# EAGLE schematic 64Pin-Final (EAGLE 7.2.0)
64 Pin Board to mount PIC24FJ1024GB606E
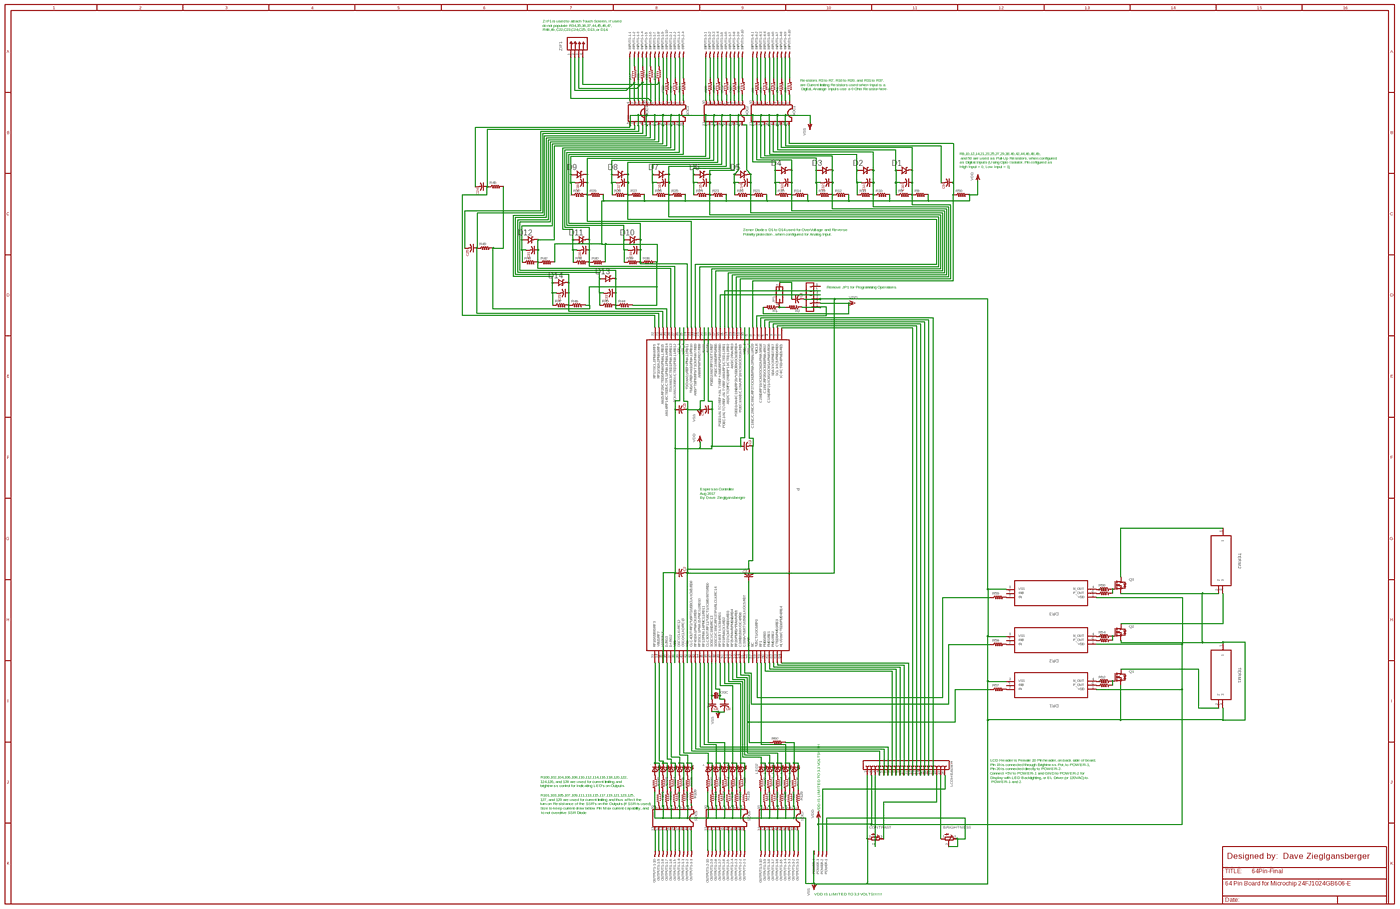
[diagram p0: schematic, sheet 1, overview]
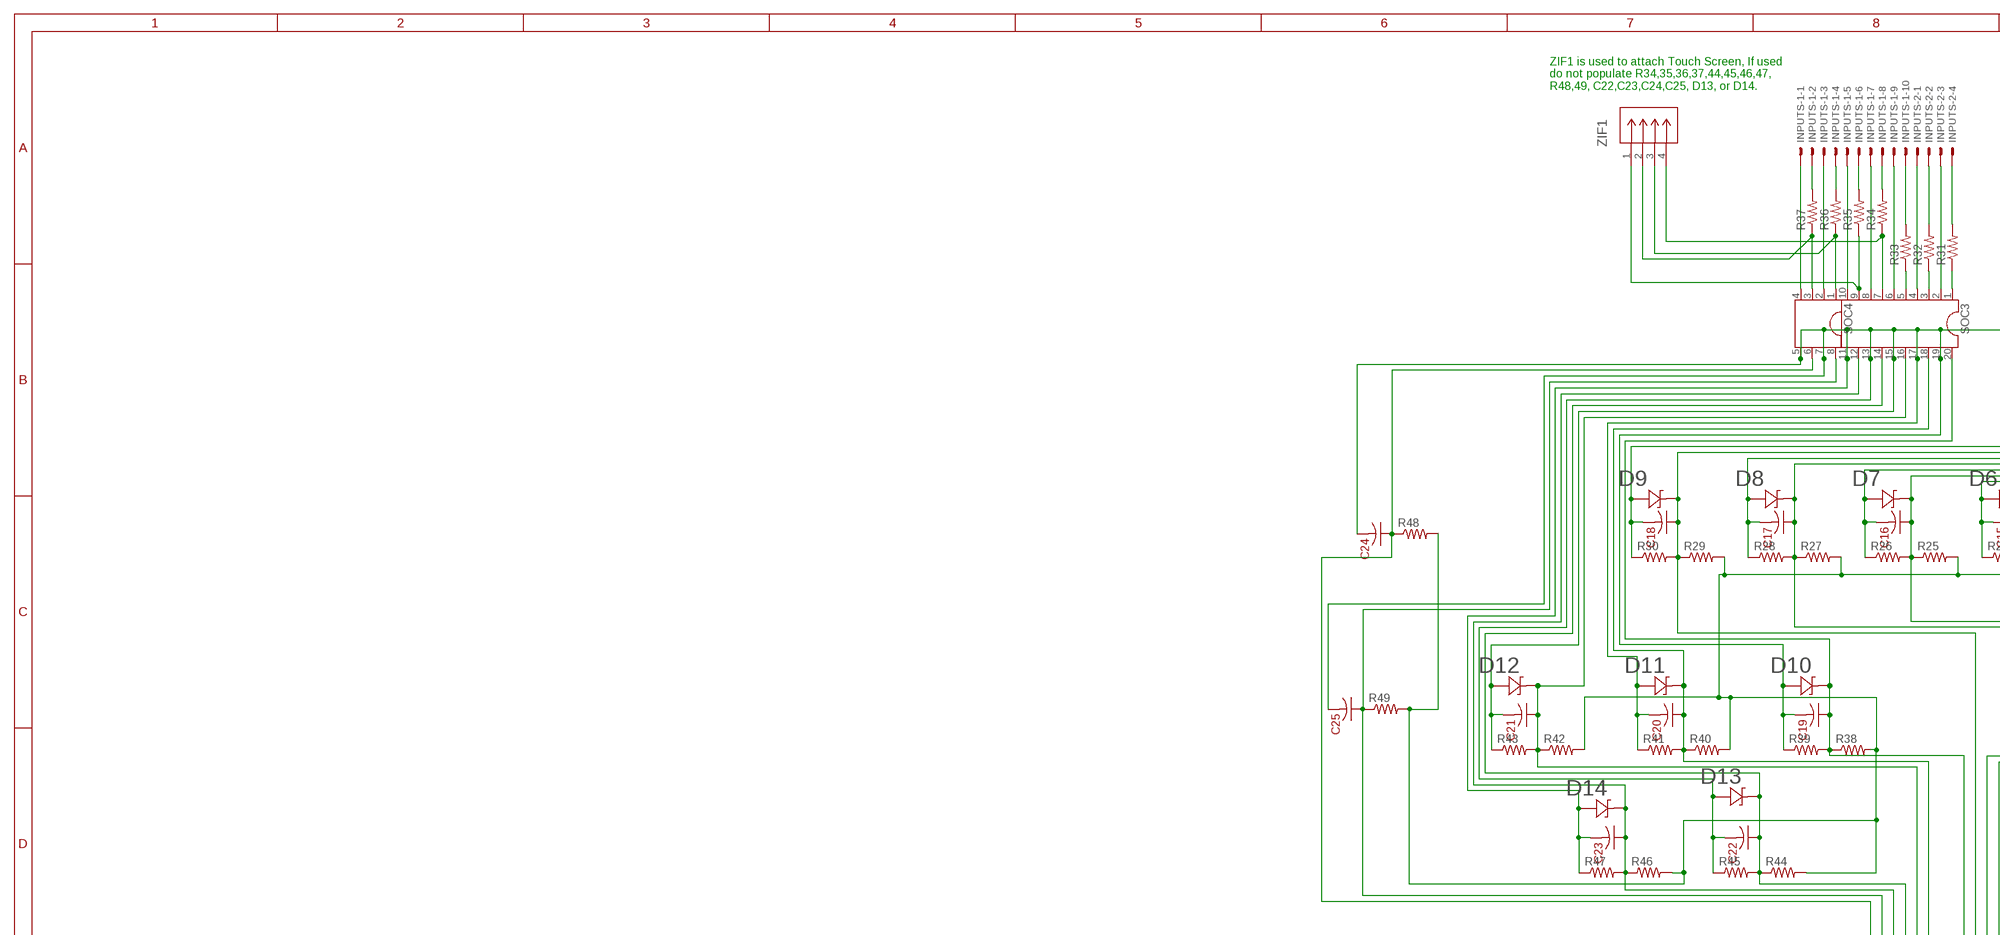
[diagram p1: schematic, sheet 1, part 1 of 4]
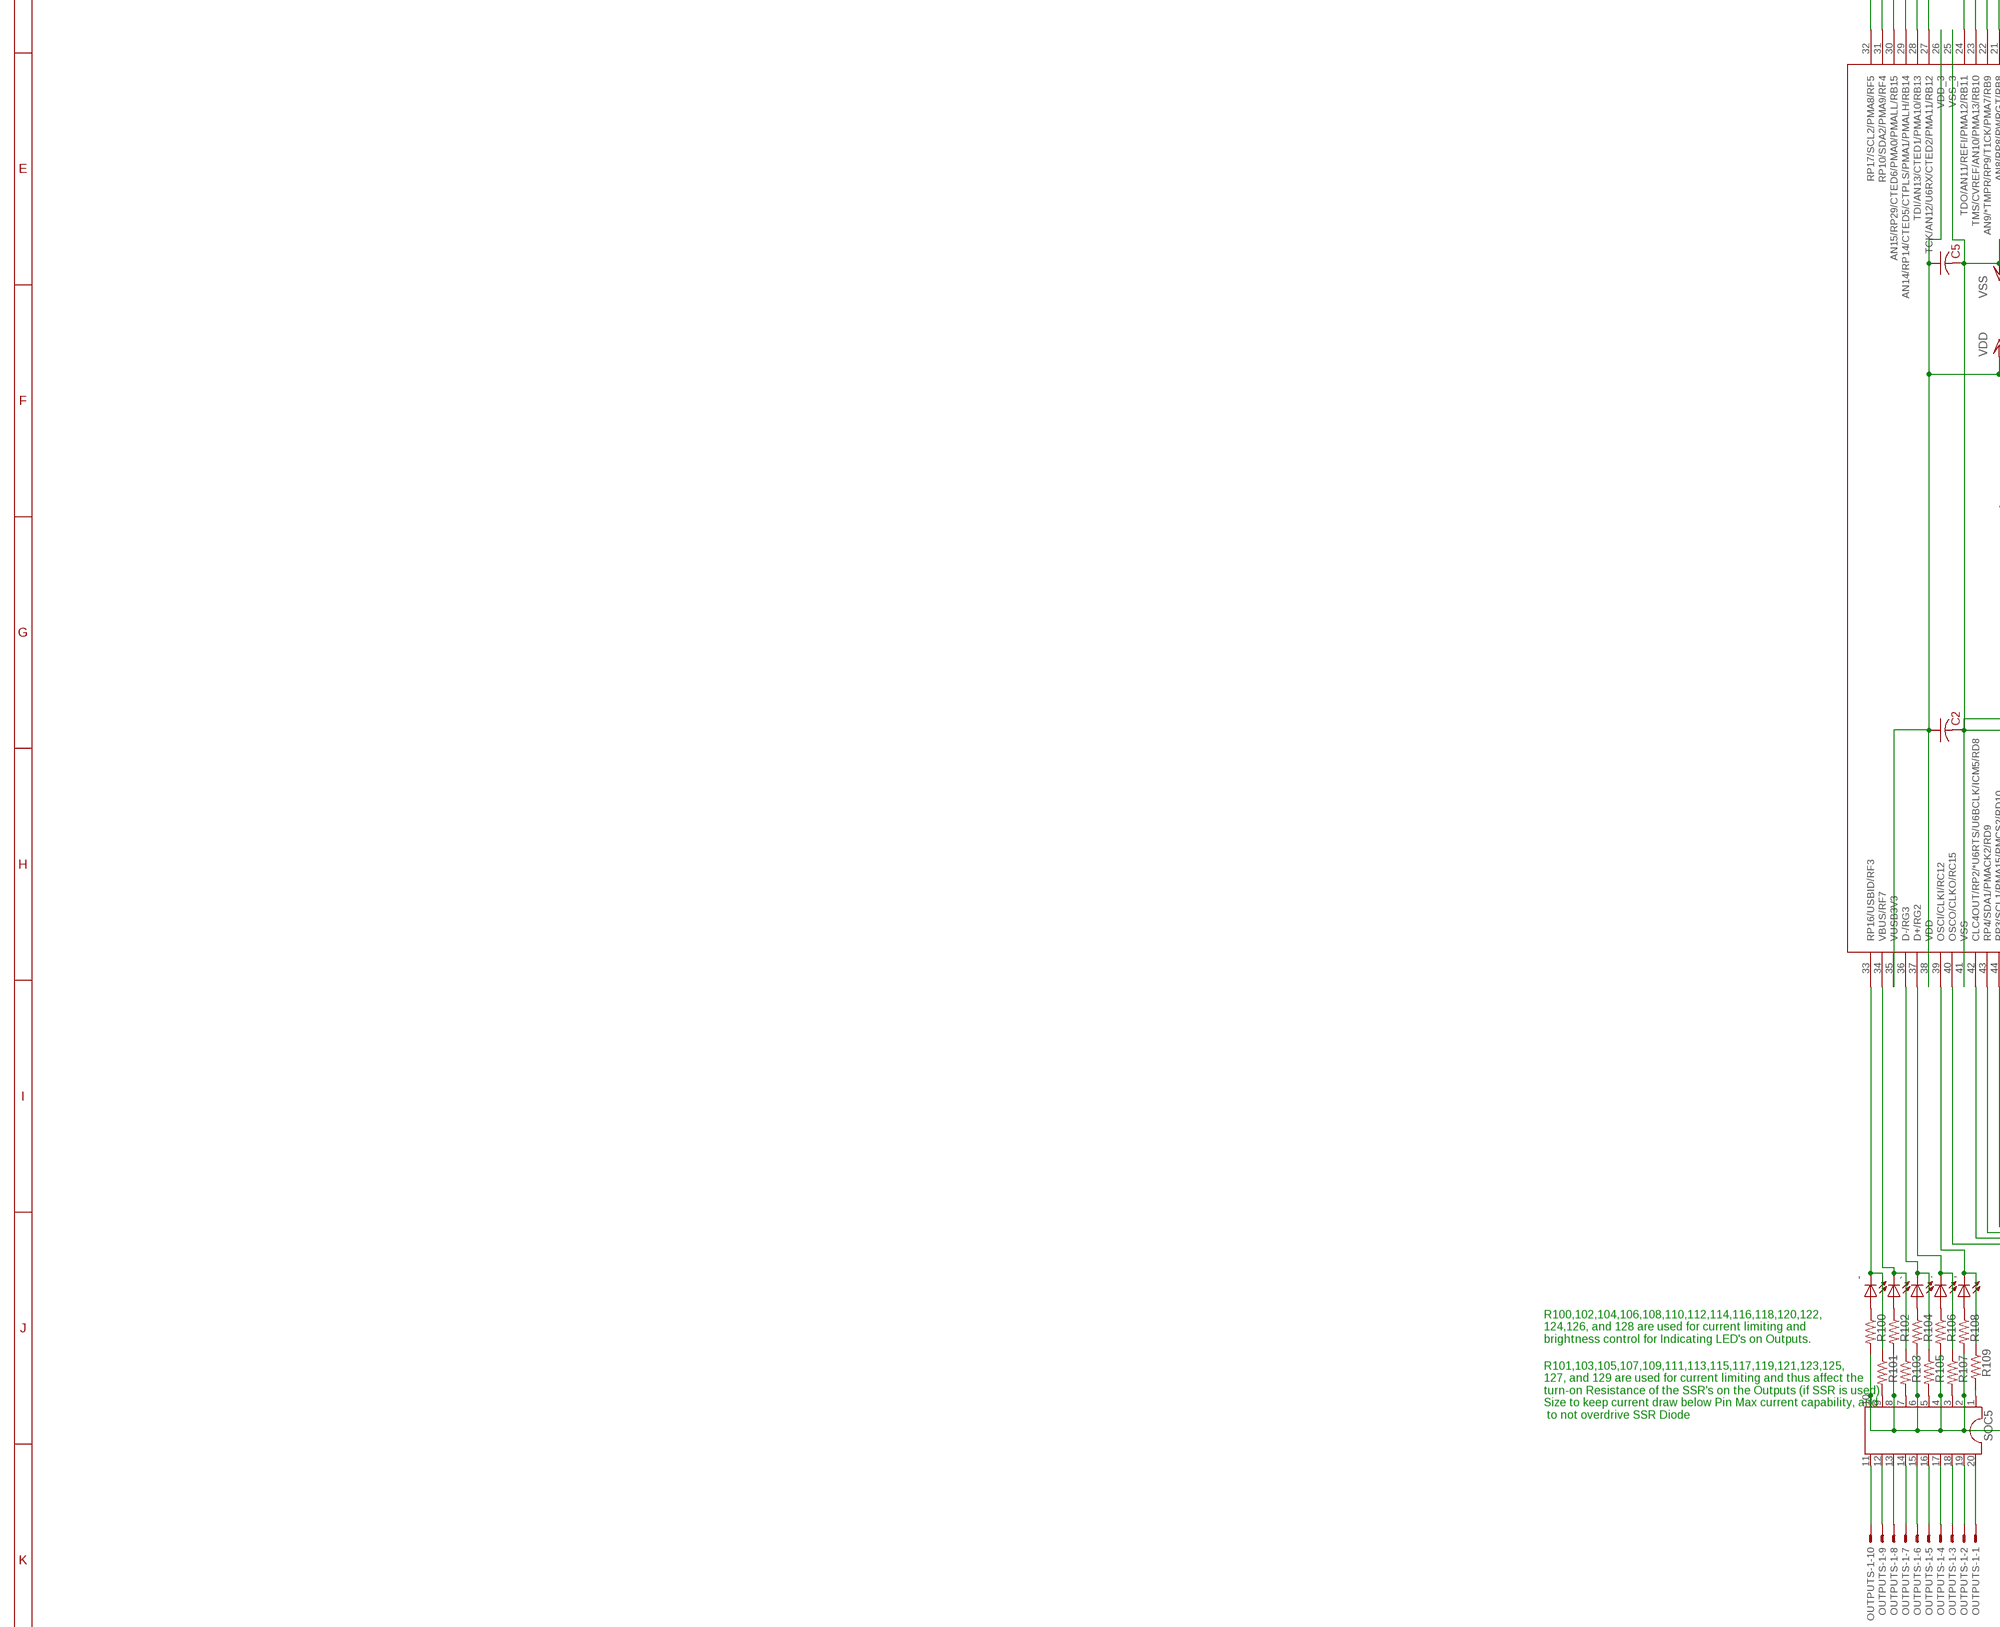
[diagram p2: schematic, sheet 1, part 2 of 4]
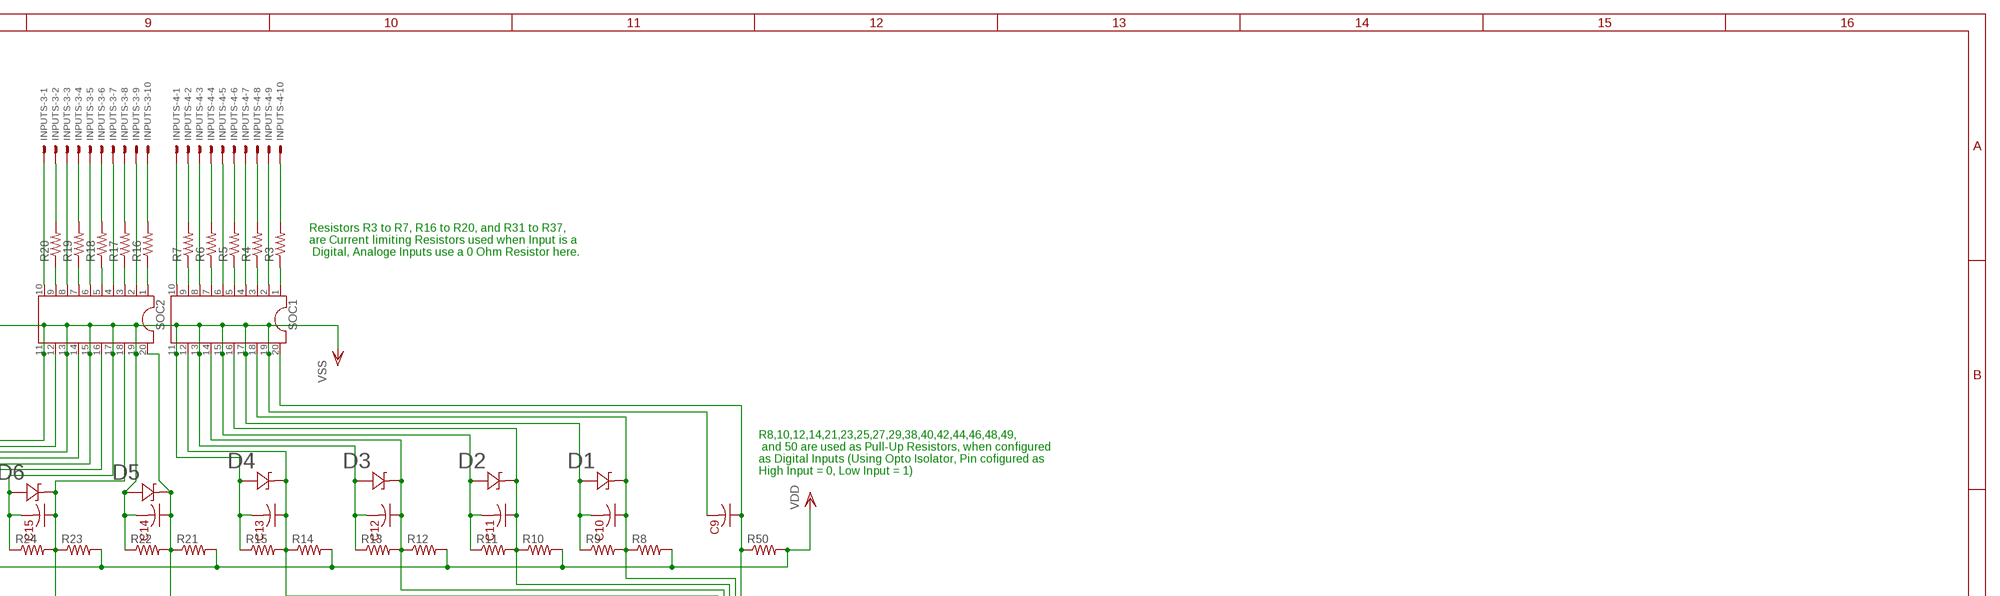
[diagram p3: schematic, sheet 1, part 3 of 4]
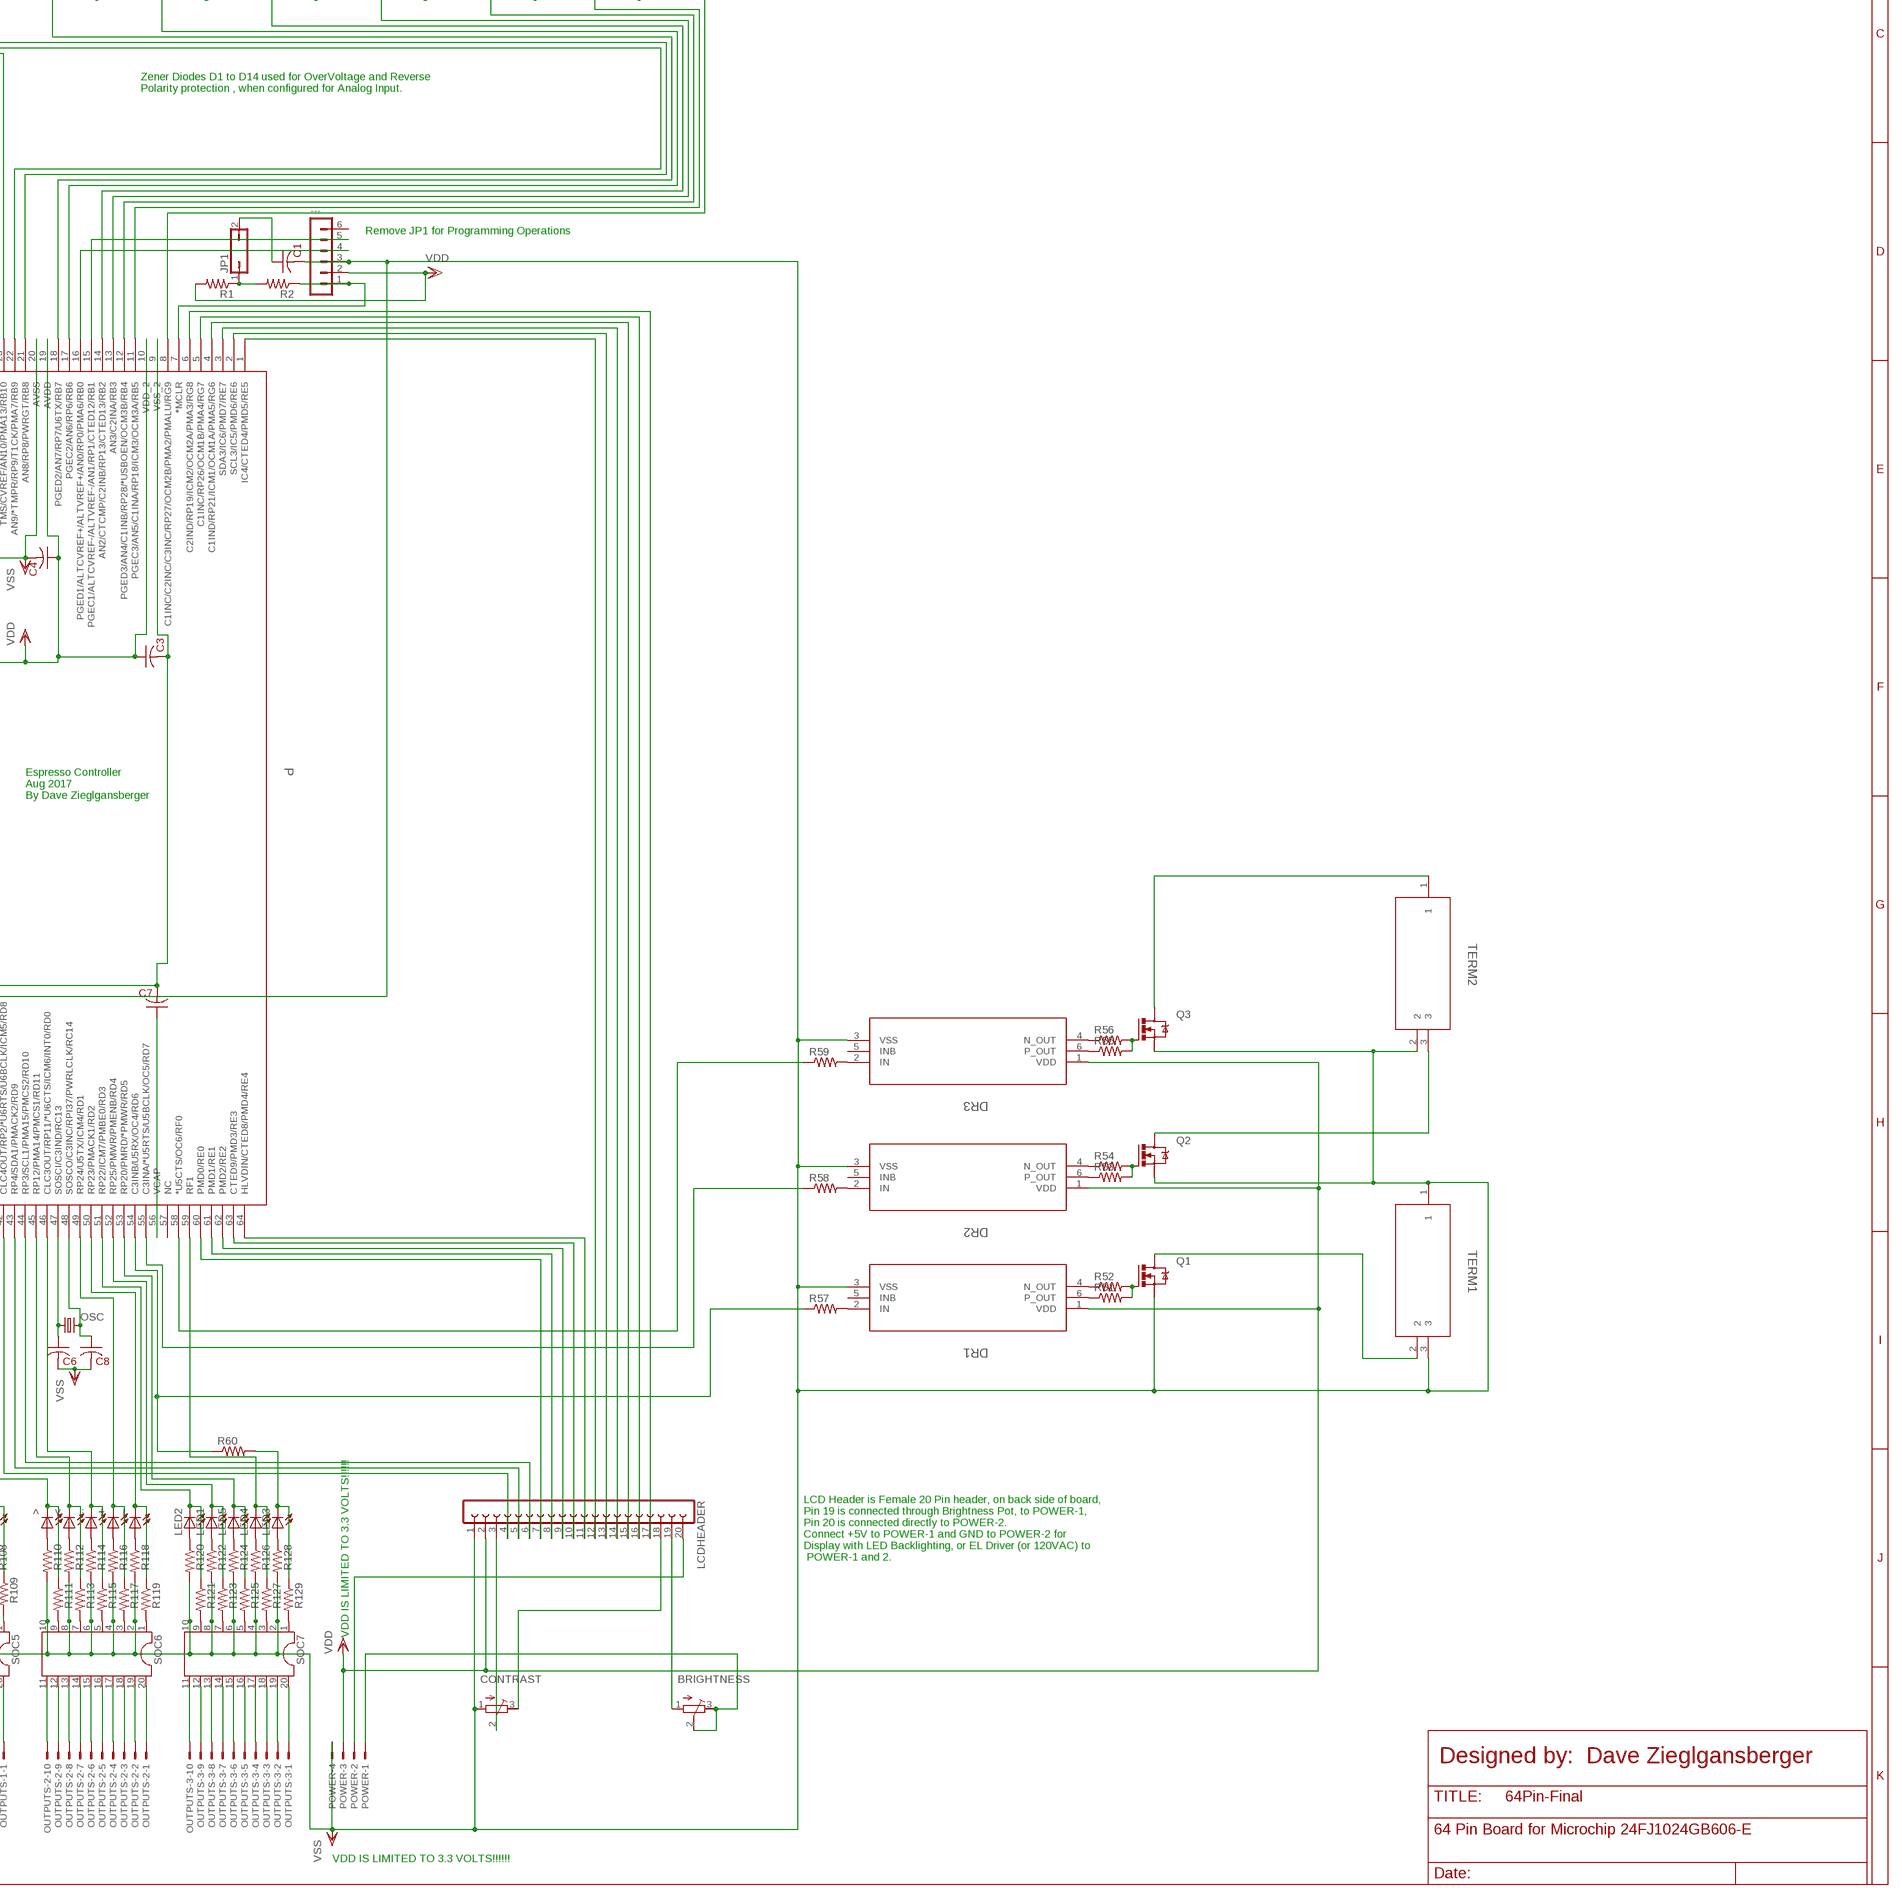
[diagram p4: schematic, sheet 1, part 4 of 4]

## Parts
+  LED_ESML0603  [LED_SML0603]
,  LED_ESML0603  [LED_SML0603]
-  LED_ESML0603  [LED_SML0603]
--  LED_ESML0603  [LED_SML0603]
---  MA06-1  [MA06-1]
.  LED_ESML0603  [LED_SML0603]
..  LED_ESML0603  [LED_SML0603]
<  LED_ESML0603  [LED_SML0603]
>  LED_ESML0603  [LED_SML0603]
`  LED_ESML0603  [LED_SML0603]
BRIGHTNESS  R-TRIMM3296W  [RTRIM3296W]
C1  C-USC0603  [C0603]
C2  C-USC0603  [C0603]
C3  C-USC0603  [C0603]
C4  C-USC0603  [C0603]
C5  C-USC0603  [C0603]
C6  C-USC0603  [C0603]
C7  C-USC0603  [C0603]
C8  C-USC0603  [C0603]
C9  C-USC0603  [C0603]
C10  C-USC0603  [C0603]
C11  C-USC0603  [C0603]
C12  C-USC0603  [C0603]
C13  C-USC0603  [C0603]
C14  C-USC0603  [C0603]
C15  C-USC0603  [C0603]
C16  C-USC0603  [C0603]
C17  C-USC0603  [C0603]
C18  C-USC0603  [C0603]
C19  C-USC0603  [C0603]
C20  C-USC0603  [C0603]
C21  C-USC0603  [C0603]
C22  C-USC0603  [C0603]
C23  C-USC0603  [C0603]
C24  C-USC0603  [C0603]
C25  C-USC0603  [C0603]
CONTRAST  R-TRIMM3296W  [RTRIM3296W]
D1  CZRU52C3V3CZRU-M  [CZRU-M]
D2  CZRU52C3V3CZRU-M  [CZRU-M]
D3  CZRU52C3V3CZRU-M  [CZRU-M]
D4  CZRU52C3V3CZRU-M  [CZRU-M]
D5  CZRU52C3V3CZRU-M  [CZRU-M]
D6  CZRU52C3V3CZRU-M  [CZRU-M]
D7  CZRU52C3V3CZRU-M  [CZRU-M]
D8  CZRU52C3V3CZRU-M  [CZRU-M]
D9  CZRU52C3V3CZRU-M  [CZRU-M]
D10  CZRU52C3V3CZRU-M  [CZRU-M]
D11  CZRU52C3V3CZRU-M  [CZRU-M]
D12  CZRU52C3V3CZRU-M  [CZRU-M]
D13  CZRU52C3V3CZRU-M  [CZRU-M]
D14  CZRU52C3V3CZRU-M  [CZRU-M]
DR1  LM5114BMFX/S7003094SOT26-GATEDRIVER  [MF06A]
DR2  LM5114BMFX/S7003094SOT26-GATEDRIVER  [MF06A]
DR3  LM5114BMFX/S7003094SOT26-GATEDRIVER  [MF06A]
INPUTS-1  22-23-2101  [22-23-2101]
INPUTS-2  22-23-2041  [22-23-2041]
INPUTS-3  22-23-2101  [22-23-2101]
INPUTS-4  22-23-2101  [22-23-2101]
JP1  JP1Q  [JP1]
LCDHEADER  FE20-1  [FE20]
LED1  LED_ESML0603  [LED_SML0603]
LED2  LED_ESML0603  [LED_SML0603]
LED3  LED_ESML0603  [LED_SML0603]
LED4  LED_ESML0603  [LED_SML0603]
LED5  LED_ESML0603  [LED_SML0603]
OSC  CRYSTALTC26H  [TC26H]
OUTPUTS-1  22-23-2101  [22-23-2101]
OUTPUTS-2  22-23-2101  [22-23-2101]
OUTPUTS-3  22-23-2101  [22-23-2101]
P  PIC24FJXXXGB606-X_PT  [TQFP64_10X10MC]
POWER  22-23-2041  [22-23-2041]
Q1  IRF540  [TO220BV]
Q2  IRF540  [TO220BV]
Q3  IRF540  [TO220BV]
R1  R-US_R0603  [R0603]
R2  R-US_R0603  [R0603]
R3  R-US_R0603  [R0603]
R4  R-US_R0603  [R0603]
R5  R-US_R0603  [R0603]
R6  R-US_R0603  [R0603]
R7  R-US_R0603  [R0603]
R8  R-US_R0603  [R0603]
R9  R-US_R0603  [R0603]
R10  R-US_R0603  [R0603]
R11  R-US_R0603  [R0603]
R12  R-US_R0603  [R0603]
R13  R-US_R0603  [R0603]
R14  R-US_R0603  [R0603]
R15  R-US_R0603  [R0603]
R16  R-US_R0603  [R0603]
R17  R-US_R0603  [R0603]
R18  R-US_R0603  [R0603]
R19  R-US_R0603  [R0603]
R20  R-US_R0603  [R0603]
R21  R-US_R0603  [R0603]
R22  R-US_R0603  [R0603]
R23  R-US_R0603  [R0603]
R24  R-US_R0603  [R0603]
R25  R-US_R0603  [R0603]
R26  R-US_R0603  [R0603]
R27  R-US_R0603  [R0603]
R28  R-US_R0603  [R0603]
R29  R-US_R0603  [R0603]
R30  R-US_R0603  [R0603]
R31  R-US_R0603  [R0603]
R32  R-US_R0603  [R0603]
R33  R-US_R0603  [R0603]
R34  R-US_R0603  [R0603]
R35  R-US_R0603  [R0603]
R36  R-US_R0603  [R0603]
R37  R-US_R0603  [R0603]
R38  R-US_R0603  [R0603]
R39  R-US_R0603  [R0603]
R40  R-US_R0603  [R0603]
R41  R-US_R0603  [R0603]
R42  R-US_R0603  [R0603]
R43  R-US_R0603  [R0603]
R44  R-US_R0603  [R0603]
R45  R-US_R0603  [R0603]
R46  R-US_R0603  [R0603]
R47  R-US_R0603  [R0603]
R48  R-US_R0603  [R0603]
R49  R-US_R0603  [R0603]
R50  R-US_R0603  [R0603]
R51  R-US_R0603  [R0603]
R52  R-US_R0603  [R0603]
R53  R-US_R0603  [R0603]
R54  R-US_R0603  [R0603]
R55  R-US_R0603  [R0603]
R56  R-US_R0603  [R0603]
R57  R-US_R0603  [R0603]
R58  R-US_R0603  [R0603]
R59  R-US_R0603  [R0603]
R60  R-US_R0603  [R0603]
R100  R-US_R0603  [R0603]
R101  R-US_R0603  [R0603]
R102  R-US_R0603  [R0603]
R103  R-US_R0603  [R0603]
R104  R-US_R0603  [R0603]
R105  R-US_R0603  [R0603]
R106  R-US_R0603  [R0603]
R107  R-US_R0603  [R0603]
R108  R-US_R0603  [R0603]
R109  R-US_R0603  [R0603]
R110  R-US_R0603  [R0603]
R111  R-US_R0603  [R0603]
R112  R-US_R0603  [R0603]
R113  R-US_R0603  [R0603]
R114  R-US_R0603  [R0603]
R115  R-US_R0603  [R0603]
R116  R-US_R0603  [R0603]
R117  R-US_R0603  [R0603]
R118  R-US_R0603  [R0603]
R119  R-US_R0603  [R0603]
R120  R-US_R0603  [R0603]
R121  R-US_R0603  [R0603]
R122  R-US_R0603  [R0603]
R123  R-US_R0603  [R0603]
R124  R-US_R0603  [R0603]
R125  R-US_R0603  [R0603]
R126  R-US_R0603  [R0603]
R127  R-US_R0603  [R0603]
R128  R-US_R0603  [R0603]
R129  R-US_R0603  [R0603]
SOC1  DIL20  [DIL20]
SOC2  DIL20  [DIL20]
SOC3  DIL20  [DIL20]
SOC4  DIL8  [DIL08]
SOC5  DIL20  [DIL20]
SOC6  DIL20  [DIL20]
SOC7  DIL20  [DIL20]
TERM1  282837-3  [282837-3]
TERM2  282837-3  [282837-3]
ZIF1  84952-4  [CON4_SMT-RA_FCC-FPC2]
~  LED_ESML0603  [LED_SML0603]

## Nets
MCLR: ---.1 P.7(*MCLR) R2.1
N$1: INPUTS-1.1 SOC4.4
N$3: R101.2 SOC5.9
N$4: JP1.1 R1.1 R2.2
N$5: INPUTS-1.2 R37.2
N$6: R103.2 SOC5.7
N$7: INPUTS-1.3 SOC4.2
N$8: R105.2 SOC5.5
N$11: INPUTS-1.4 R36.2
N$13: R107.2 SOC5.3
N$17: INPUTS-1.5 SOC3.10
N$19: R36.1 SOC4.1 ZIF1.3
N$20: C1.1 JP1.2
N$21: R37.1 SOC4.3 ZIF1.2
N$23: INPUTS-1.6 R35.2
N$24: INPUTS-1.7 SOC3.8
N$25: INPUTS-1.8 R34.2
N$26: INPUTS-1.9 SOC3.6
N$27: R109.2 SOC5.1
N$28: INPUTS-1.10 R33.2
N$29: INPUTS-2.1 SOC3.4
N$30: INPUTS-2.2 R32.2
N$31: INPUTS-2.3 SOC3.2
N$32: INPUTS-2.4 R31.2
N$33: DR2.4(N_OUT) R54.1
N$34: DR2.6(P_OUT) R53.1
N$35: DR1.4(N_OUT) R52.1
N$36: -.A R100.1
N$37: --.A R102.1
N$38: `.A R104.1
N$39: ..A R106.1
N$40: ,.A R108.1
N$41: DR1.6(P_OUT) R51.1
N$42: >.A R110.1
N$43: R111.2 SOC6.9
N$44: INPUTS-4.5 SOC1.6
N$45: INPUTS-4.4 R6.2
N$46: Q3.D TERM2.1
N$47: R113.2 SOC6.7
N$48: Q1.G R51.2 R52.2
N$49: R115.2 SOC6.5
N$50: Q2.G R53.2 R54.2
N$51: R117.2 SOC6.3
N$52: DR3.4(N_OUT) R56.1
N$53: R119.2 SOC6.1
N$54: R6.1 SOC1.7
N$55: R118.1 ~.A
N$56: +.A R116.1
N$57: ...A R114.1
N$58: <.A R112.1
N$59: DR3.6(P_OUT) R55.1
N$60: R121.2 SOC7.9
N$61: Q3.G R55.2 R56.2
N$62: R123.2 SOC7.7
N$63: LCDHEADER.20 POWER.2
N$64: R125.2 SOC7.5
N$65: Q2.D TERM2.3
N$66: R127.2 SOC7.3
N$68: R129.2 SOC7.1
N$69: LED3.A R128.1
N$70: LED4.A R126.1
N$71: LED5.A R124.1
N$72: LED1.A R122.1
N$73: LED2.A R120.1
N$74: Q1.D TERM1.2
N$75: BRIGHTNESS.1(A) LCDHEADER.19
N$76 [VDD]: BRIGHTNESS.2(S) BRIGHTNESS.3(E) POWER.1
N$77: DR1.2(IN) R57.2
N$78: DR2.2(IN) R58.2
N$79: DR3.2(IN) R59.2
N$80: P.55(C3INA/*U5RTS/U5BCLK/OC5/RD7) R58.1
N$81: P.58(*U5CTS/OC6/RF0) R59.1
N$84: R35.1 SOC3.9 ZIF1.1
N$87: R34.1 SOC3.7 ZIF1.4
N$90: R33.1 SOC3.5
N$93: R32.1 SOC3.3
N$95: R31.1 SOC3.1
N$96: INPUTS-3.1 SOC2.10
N$98: R20.1 SOC2.9
N$99: INPUTS-3.3 SOC2.8
N$100: INPUTS-3.2 R20.2
N$101: INPUTS-3.4 R19.2
N$102: INPUTS-3.5 SOC2.6
N$103: R19.1 SOC2.7
N$104: INPUTS-3.7 SOC2.4
N$105: R17.1 SOC2.3
N$106: INPUTS-3.8 R17.2
N$107: INPUTS-3.9 SOC2.2
N$108: R16.1 SOC2.1
N$109: INPUTS-3.10 R16.2
N$110: INPUTS-4.1 SOC1.10
N$111: INPUTS-4.2 R7.2
N$112: R7.1 SOC1.9
N$113: INPUTS-4.3 SOC1.8
N$114: R18.1 SOC2.5
N$115: INPUTS-3.6 R18.2
N$116: INPUTS-4.6 R5.2
N$117: R5.1 SOC1.5
N$118: INPUTS-4.7 SOC1.4
N$119: INPUTS-4.8 R4.2
N$120: R4.1 SOC1.3
N$121: INPUTS-4.9 SOC1.2
N$122: INPUTS-4.10 R3.2
N$123: R3.1 SOC1.1
N$149: CONTRAST.2(S) LCDHEADER.3
N$151: CONTRAST.3(E) LCDHEADER.18
OUT: LED3.C R60.2 R129.1
OUT1-1: OUTPUTS-1.10 SOC5.11
OUT1-2 [Output Traces]: OUTPUTS-1.9 SOC5.12
OUT2-1: OUTPUTS-1.8 SOC5.13
OUT2-2: OUTPUTS-1.7 SOC5.14
OUT3-1: OUTPUTS-1.6 SOC5.15
OUT3-2: OUTPUTS-1.5 SOC5.16
OUT4-1: OUTPUTS-1.4 SOC5.17
OUT4-2: OUTPUTS-1.3 SOC5.18
OUT5-1: OUTPUTS-1.2 SOC5.19
OUT5-2: OUTPUTS-1.1 SOC5.20
OUT6-1: OUTPUTS-2.10 SOC6.11
OUT6-2: OUTPUTS-2.9 SOC6.12
OUT7-1: OUTPUTS-2.8 SOC6.13
OUT7-2: OUTPUTS-2.7 SOC6.14
OUT8-1: OUTPUTS-2.6 SOC6.15
OUT8-2: OUTPUTS-2.5 SOC6.16
OUT9-1: OUTPUTS-2.4 SOC6.17
OUT9-2: OUTPUTS-2.3 SOC6.18
OUT10-1: OUTPUTS-2.2 SOC6.19
OUT10-2: OUTPUTS-2.1 SOC6.20
OUT11-1: OUTPUTS-3.10 SOC7.11
OUT11-2: OUTPUTS-3.9 SOC7.12
OUT12-1: OUTPUTS-3.8 SOC7.13
OUT12-2: OUTPUTS-3.7 SOC7.14
OUT13-1: OUTPUTS-3.6 SOC7.15
OUT13-2: OUTPUTS-3.5 SOC7.16
OUT14-1: OUTPUTS-3.4 SOC7.17
OUT14-2: OUTPUTS-3.3 SOC7.18
OUT15-1: OUTPUTS-3.2 SOC7.19
OUT15-2: OUTPUTS-3.1 SOC7.20
PGEC1: ---.5 P.15(PGEC1/ALTCVREF-/ALTVREF-/AN1/RP1/CTED12/RB1)
PGECD: ---.4 P.16(PGED1/ALTCVREF+/ALTVREF+/AN0/RP0/PMA6/RB0)
PIN1: LCDHEADER.12 P.1(IC4/CTED4/PMD5/RE5)
PIN2: LCDHEADER.13 P.2(SCL3/IC5/PMD6/RE6)
PIN3: LCDHEADER.14 P.3(SDA3/IC6/PMD7/RE7)
PIN4: LCDHEADER.15 P.4(C1IND/RP21/ICM1/OCM1A/PMA5/RG6)
PIN5: LCDHEADER.16 P.5(C1INC/RP26/OCM1B/PMA4/RG7)
PIN6: LCDHEADER.17 P.6(C2IND/RP19/ICM2/OCM2A/PMA3/RG8)
PIN8: C9.1 P.8(C1INC/C2INC/C3INC/RP27/OCM2B/PMA2/PMALU/RG9) R50.1 SOC1.20
PIN11: C10.1 D1.1 P.11(PGEC3/AN5/C1INA/RP18/ICM3/OCM3A/RB5) R8.1 R9.2 SOC1.18
PIN12: C11.1 D2.1 P.12(PGED3/AN4/C1INB/RP28/*USBOEN/OCM3B/RB4) R10.1 R11.2 SOC1.16
PIN13: C12.1 D3.1 P.13(AN3/C2INA/RB3) R12.1 R13.2 SOC1.14
PIN14: C13.1 D4.1 P.14(AN2/CTCMP/C2INB/RP13/CTED13/RB2) R14.1 R15.2 SOC1.12
PIN17: C14.1 D5.1 P.17(PGEC2/AN6/RP6/RB6) R21.1 R22.2 SOC2.20
PIN18: C15.1 D6.1 P.18(PGED2/AN7/RP7/U6TX/RB7) R23.1 R24.2 SOC2.18
PIN21: C16.1 D7.1 P.21(AN8/RP8/PWRGT/RB8) R25.1 R26.2 SOC2.16
PIN22: C17.1 D8.1 P.22(AN9/*TMPR/RP9/T1CK/PMA7/RB9) R27.1 R28.2 SOC2.14
PIN23: C18.1 D9.1 P.23(TMS/CVREF/AN10/PMA13/RB10) R29.1 R30.2 SOC2.12
PIN24: C19.1 D10.1 P.24(TDO/AN11/REFI/PMA12/RB11) R38.1 R39.2 SOC3.20
PIN27: C20.1 D11.1 P.27(TCK/AN12/U6RX/CTED2/PMA11/RB12) R40.1 R41.2 SOC3.18
PIN28: C21.1 D12.1 P.28(TDI/AN13/CTED1/PMA10/RB13) R42.1 R43.2 SOC3.16
PIN29: C22.1 D13.1 P.29(AN14/RP14/CTED5/CTPLS/PMA1/PMALH/RB14) R44.1 R45.2 SOC3.14
PIN30: C23.1 D14.1 P.30(AN15/RP29/CTED6/PMA0/PMALL/RB15) R46.1 R47.2 SOC3.12
PIN31: C25.1 P.31(RP10/SDA2/PMA9/RF4) R49.1 SOC4.8
PIN32: C24.1 P.32(RP17/SCL2/PMA8/RF5) R48.1 SOC4.6
PIN33: -.C P.33(RP16/USBID/RF3) R101.1
PIN34: --.C P.34(VBUS/RF7) R103.1
PIN36: `.C P.36(D-/RG3) R105.1
PIN37: ..C P.37(D+/RG2) R107.1
PIN39: ,.C P.39(OSCI/CLKI/RC12) R109.1
PIN40: >.C P.40(OSCO/CLKO/RC15) R111.1
PIN42: LCDHEADER.4 P.42(CLC4OUT/RP2/*U6RTS/U6BCLK/ICM5/RD8)
PIN43: LCDHEADER.5 P.43(RP4/SDA1/PMACK2/RD9)
PIN44: LCDHEADER.6 P.44(RP3/SCL1/PMA15/PMCS2/RD10)
PIN45: <.C P.45(RP12/PMA14/PMCS1/RD11) R113.1
PIN46: ...C P.46(CLC3OUT/RP11/*U6CTS/ICM6/INT0/RD0) R115.1
PIN49: +.C P.49(RP24/U5TX/ICM4/RD1) R117.1
PIN50: P.50(RP23/PMACK1/RD2) R119.1 ~.C
PIN51: LED2.C P.51(RP22/ICM7/PMBE0/RD3) R121.1
PIN52: LED1.C P.52(RP25/PMWR/PMENB/RD4) R123.1
PIN53: LED5.C P.53(RP20/PMRD/*PMWR/RD5) R125.1
PIN54: P.54(C3INB/U5RX/OC4/RD6) R57.1 R60.1
PIN59: LED4.C P.59(RF1) R127.1
PIN60: LCDHEADER.7 P.60(PMD0/RE0)
PIN61: LCDHEADER.8 P.61(PMD1/RE1)
PIN62: LCDHEADER.9 P.62(PMD2/RE2)
PIN63: LCDHEADER.10 P.63(CTED9/PMD3/RE3)
PIN64: LCDHEADER.11 P.64(HLVDIN/CTED8/PMD4/RE4)
SOSCI: C6.1 OSC.1 P.47(SOSCI/C3IND/RC13)
SOSCO: C8.1 OSC.2 P.48(SOSCO/C3INC/RPI37/PWRLCLK/RC14)
VCAP: C7.1 P.56(VCAP)
VDD [VDD]: ---.2 C2.1 C3.1 C4.1 C5.1 DR1.1(VDD) DR2.1(VDD) DR3.1(VDD) LCDHEADER.2 P.10(VDD_2) P.19(AVDD) P.26(VDD_3) P.35(VUSB3V3) P.38(VDD) POWER.3 R1.2 R8.2 R10.2 R12.2 R14.2 R21.2 R23.2 R25.2 R27.2 R29.2 R38.2 R40.2 R42.2 R44.2 R46.2 R48.2 R49.2 R50.2
VSS [VSS]: ---.3 C1.2 C2.2 C3.2 C4.2 C5.2 C6.2 C7.2 C8.2 C9.2 C10.2 C11.2 C12.2 C13.2 C14.2 C15.2 C16.2 C17.2 C18.2 C19.2 C20.2 C21.2 C22.2 C23.2 C24.2 C25.2 CONTRAST.1(A) D1.2 D2.2 D3.2 D4.2 D5.2 D6.2 D7.2 D8.2 D9.2 D10.2 D11.2 D12.2 D13.2 D14.2 DR1.3(VSS) DR2.3(VSS) DR3.3(VSS) LCDHEADER.1 P.9(VSS_2) P.20(AVSS) P.25(VSS_3) P.41(VSS) POWER.4 Q1.S Q2.S Q3.S R9.1 R11.1 R13.1 R15.1 R22.1 R24.1 R26.1 R28.1 R30.1 R39.1 R41.1 R43.1 R45.1 R47.1 R100.2 R102.2 R104.2 R106.2 R108.2 R110.2 R112.2 R114.2 R116.2 R118.2 R120.2 R122.2 R124.2 R126.2 R128.2 SOC1.11 SOC1.13 SOC1.15 SOC1.17 SOC1.19 SOC2.11 SOC2.13 SOC2.15 SOC2.17 SOC2.19 SOC3.11 SOC3.13 SOC3.15 SOC3.17 SOC3.19 SOC4.5 SOC4.7 SOC5.2 SOC5.4 SOC5.6 SOC5.8 SOC5.10 SOC6.2 SOC6.4 SOC6.6 SOC6.8 SOC6.10 SOC7.2 SOC7.4 SOC7.6 SOC7.8 SOC7.10 TERM1.1 TERM1.3 TERM2.2
Unconnected: ---.6 DR1.5(INB) DR2.5(INB) DR3.5(INB) P.57(NC)

## Notes on the sheet
- ZIF1 is used to attach Touch Screen, If used
  do not populate R34,35,36,37,44,45,46,47,
  R48,49, C22,C23,C24,C25, D13, or D14.
- Resistors R3 to R7, R16 to R20, and R31 to R37,
  are Current limiting Resistors used when Input is a
   Digital, Analoge Inputs use a 0 Ohm Resistor here.
- R8,10,12,14,21,23,25,27,29,38,40,42,44,46,48,49,
   and 50 are used as Pull-Up Resistors, when configured
  as Digital Inputs (Using Opto Isolator, Pin cofigured as
  High Input = 0, Low Input = 1)
- Zener Diodes D1 to D14 used for OverVoltage and Reverse
  Polarity protection , when configured for Analog Input.
- Remove JP1 for Programming Operations
- Espresso Controller
  Aug 2017
  By Dave Zieglgansberger
- LCD Header is Female 20 Pin header, on back side of board,
  Pin 19 is connected through Brightness Pot, to POWER-1, 
  Pin 20 is connected directly to POWER-2. 
  Connect +5V to POWER-1 and GND to POWER-2 for
  Display with LED Backlighting, or EL Driver (or 120VAC) to
   POWER-1 and 2.
- R100,102,104,106,108,110,112,114,116,118,120,122,
  124,126, and 128 are used for current limiting and 
  brightness control for Indicating LED's on Outputs.
- VDD IS LIMITED TO 3.3 VOLTS!!!!!!
- R101,103,105,107,109,111,113,115,117,119,121,123,125,
  127, and 129 are used for current limiting and thus affect the 
  turn-on Resistance of the SSR's on the Outputs (if SSR is used)
  Size to keep current draw below Pin Max current capability, and
   to not overdrive SSR Diode
- VDD IS LIMITED TO 3.3 VOLTS!!!!!!

## Library data of the parts
+ , - -- . .. < > ` LED1-LED5 ~ = eagle-ltspice:LED_E: LED Source: http://www.osram.convergy.de Source: www.luxeon.com Source: www.kingbright.com; SPICEMODEL: NONE; SPICEPREFIX: D; SPICETYPE: diode
--- = con-lstb:MA06-1: PIN HEADER; OC_FARNELL: unknown; OC_NEWARK: unknown
BRIGHTNESS CONTRAST = rcl:R-TRIMM: Trimm resistor
C1-C25 = rcl:C-US: CAPACITOR, American symbol
D1-D14 = 0603ZenerDiode:CZRU52C3V3; MANUFACTURER_PART_NUMBER: CZRU52C3V3; VENDOR: Comchip
DR1-DR3 = SOT26:LM5114BMFX/S7003094: SOT26 Gate Driver
INPUTS-1 INPUTS-3 INPUTS-4 OUTPUTS-1-OUTPUTS-3 = con-molex:22-23-2101: .100" (2.54mm) Center Header - 10 Pin; MF: MOLEX; MPN: 22-23-2101; OC_FARNELL: 1756828; OC_NEWARK: 94C0765
INPUTS-2 POWER = con-molex:22-23-2041: .100" (2.54mm) Center Header - 4 Pin; MF: MOLEX; MPN: 22-23-2041; OC_FARNELL: 1462920; OC_NEWARK: 38C0355
JP1 = jumper:JP1Q: JUMPER
LCDHEADER = con-lsta:FE20-1: FEMALE HEADER; OC_FARNELL: unknown; OC_NEWARK: unknown
OSC = crystal:CRYSTAL: CRYSTAL; MF: 32.768KHz; OC_FARNELL: unknown; OC_NEWARK: unknown
P = 24FJ1024GB606PT:PIC24FJXXXGB606-X_PT; MANUFACTURER_PART_NUMBER: pic24fjxxxgb606-x_pt; VENDOR: Microchip
Q1-Q3 = transistor-power:IRF540: HEXFET Power MOSFET
R1-R60 R100-R129 = resistor:R-US_: RESISTOR, American symbol
SOC1-SOC3 SOC5-SOC7 = ic-package:DIL20: Dual In Line / Socket
SOC4 = ic-package:DIL8: Dual In Line / Socket
TERM1 TERM2 = 3-Pin-5.08:282837-3; MANUFACTURER_PART_NUMBER: 2828373; VENDOR: Tyco Electronics
ZIF1 = ZIF-4:84952-4; MANUFACTURER_PART_NUMBER: 849524; VENDOR: Tyco Electronics

## Net classes
0 default: width 0.254 mm, clearance 0.205 mm
1 VDD: width 0.254 mm
2 VSS: width 0.254 mm
3 Output Traces: width 0.508 mm